# Altium schematic sheet P05_LED, Config, & Button.SchDoc
size A
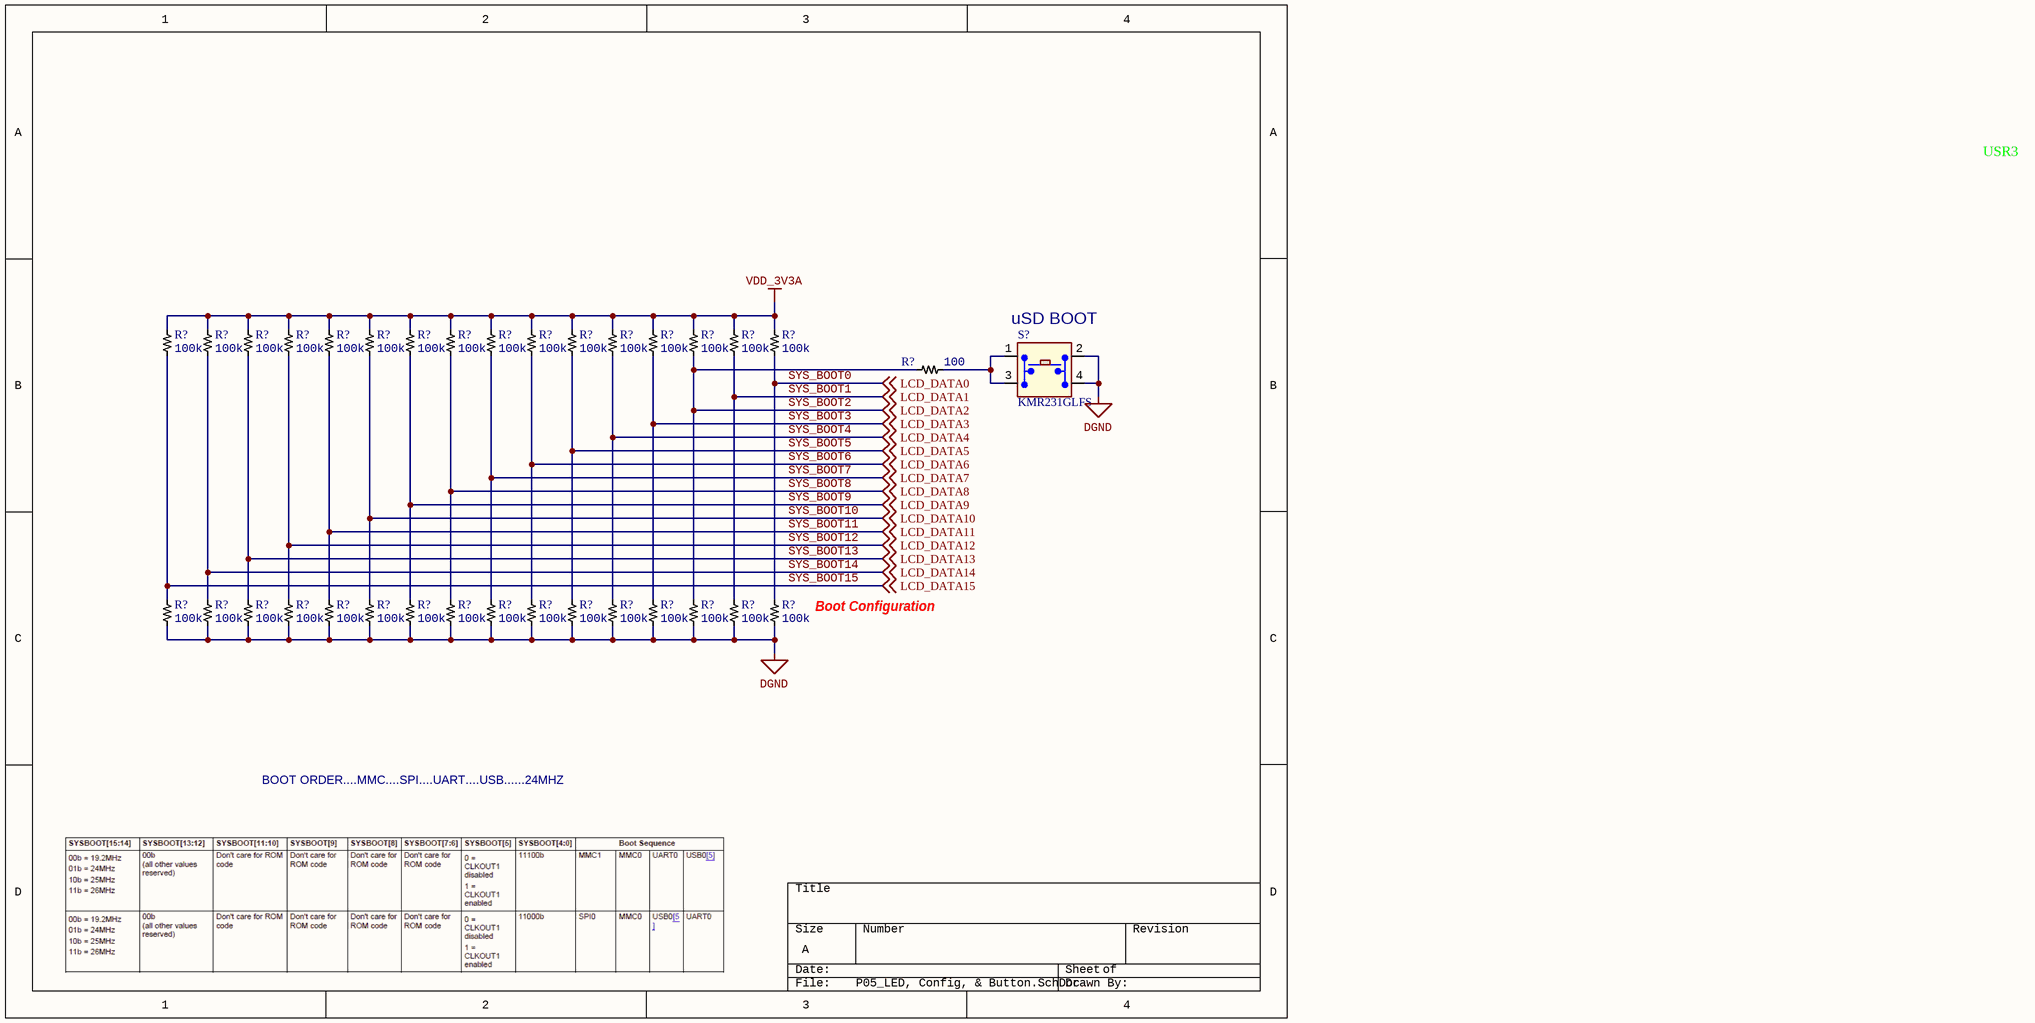
[diagram p0: P05_LED, Config, & Button.SchDoc]

## Parts
(Parts that share a designator on the sheet are numbered #1, #2 ... from top to bottom, then left to right.)
R?#1  Resistance: 100k  [RES0402]  (hidden comment: RC0402FR-07100KL)
R?#2  Resistance: 100k  [RES0402]  (hidden comment: RC0402FR-07100KL)
R?#3  Resistance: 100k  [RES0402]  (hidden comment: RC0402FR-07100KL)
R?#4  Resistance: 100k  [RES0402]  (hidden comment: RC0402FR-07100KL)
R?#5  Resistance: 100k  [RES0402]  (hidden comment: RC0402FR-07100KL)
R?#6  Resistance: 100k  [RES0402]  (hidden comment: RC0402FR-07100KL)
R?#7  Resistance: 100k  [RES0402]  (hidden comment: RC0402FR-07100KL)
R?#8  Resistance: 100k  [RES0402]  (hidden comment: RC0402FR-07100KL)
R?#9  Resistance: 100k  [RES0402]  (hidden comment: RC0402FR-07100KL)
R?#10  Resistance: 100k  [RES0402]  (hidden comment: RC0402FR-07100KL)
R?#11  Resistance: 100k  [RES0402]  (hidden comment: RC0402FR-07100KL)
R?#12  Resistance: 100k  [RES0402]  (hidden comment: RC0402FR-07100KL)
R?#13  Resistance: 100k  [RES0402]  (hidden comment: RC0402FR-07100KL)
R?#14  Resistance: 100k  [RES0402]  (hidden comment: RC0402FR-07100KL)
R?#15  Resistance: 100k  [RES0402]  (hidden comment: RC0402FR-07100KL)
R?#16  Resistance: 100k  [RES0402]  (hidden comment: RC0402FR-07100KL)
R?#17  Resistance: 100  [RES0402]  (hidden comment: RC0402FR-07100RL)
R?#18  Resistance: 100k  [RES0402]  (hidden comment: RC0402FR-07100KL)
R?#19  Resistance: 100k  [RES0402]  (hidden comment: RC0402FR-07100KL)
R?#20  Resistance: 100k  [RES0402]  (hidden comment: RC0402FR-07100KL)
R?#21  Resistance: 100k  [RES0402]  (hidden comment: RC0402FR-07100KL)
R?#22  Resistance: 100k  [RES0402]  (hidden comment: RC0402FR-07100KL)
R?#23  Resistance: 100k  [RES0402]  (hidden comment: RC0402FR-07100KL)
R?#24  Resistance: 100k  [RES0402]  (hidden comment: RC0402FR-07100KL)
R?#25  Resistance: 100k  [RES0402]  (hidden comment: RC0402FR-07100KL)
R?#26  Resistance: 100k  [RES0402]  (hidden comment: RC0402FR-07100KL)
R?#27  Resistance: 100k  [RES0402]  (hidden comment: RC0402FR-07100KL)
R?#28  Resistance: 100k  [RES0402]  (hidden comment: RC0402FR-07100KL)
R?#29  Resistance: 100k  [RES0402]  (hidden comment: RC0402FR-07100KL)
R?#30  Resistance: 100k  [RES0402]  (hidden comment: RC0402FR-07100KL)
R?#31  Resistance: 100k  [RES0402]  (hidden comment: RC0402FR-07100KL)
R?#32  Resistance: 100k  [RES0402]  (hidden comment: RC0402FR-07100KL)
R?#33  Resistance: 100k  [RES0402]  (hidden comment: RC0402FR-07100KL)
S?  KMR231GLFS  [SW4SMD_63X161LS]

## Nets
DGND: R?#18.1 R?#19.1 R?#20.1 R?#21.1 R?#22.1 R?#23.1 R?#24.1 R?#25.1 R?#26.1 R?#27.1 R?#28.1 R?#29.1 R?#30.1 R?#31.1 R?#32.1 R?#33.1 S?.2(A2) S?.4
VDD_3V3A: R?#1.2 R?#2.2 R?#3.2 R?#4.2 R?#5.2 R?#6.2 R?#7.2 R?#8.2 R?#9.2 R?#10.2 R?#11.2 R?#12.2 R?#13.2 R?#14.2 R?#15.2 R?#16.2
SYS_BOOT0: R?#16.1 R?#33.2 ; off-sheet LCD_DATA0  [also labelled LCD_DATA0]
SYS_BOOT1: R?#15.1 R?#32.2 ; off-sheet LCD_DATA1  [also labelled LCD_DATA1]
SYS_BOOT2: R?#14.1 R?#17.1 R?#31.2 ; off-sheet LCD_DATA2  [also labelled LCD_DATA2]
SYS_BOOT3: R?#13.1 R?#30.2 ; off-sheet LCD_DATA3  [also labelled LCD_DATA3]
SYS_BOOT4: R?#12.1 R?#29.2 ; off-sheet LCD_DATA4  [also labelled LCD_DATA4]
SYS_BOOT5: R?#11.1 R?#28.2 ; off-sheet LCD_DATA5  [also labelled LCD_DATA5]
SYS_BOOT6: R?#10.1 R?#27.2 ; off-sheet LCD_DATA6  [also labelled LCD_DATA6]
SYS_BOOT7: R?#9.1 R?#26.2 ; off-sheet LCD_DATA7  [also labelled LCD_DATA7]
SYS_BOOT8: R?#8.1 R?#25.2 ; off-sheet LCD_DATA8  [also labelled LCD_DATA8]
SYS_BOOT9: R?#7.1 R?#24.2 ; off-sheet LCD_DATA9  [also labelled LCD_DATA9]
SYS_BOOT10: R?#6.1 R?#23.2 ; off-sheet LCD_DATA10  [also labelled LCD_DATA10]
SYS_BOOT11: R?#5.1 R?#22.2 ; off-sheet LCD_DATA11  [also labelled LCD_DATA11]
SYS_BOOT12: R?#4.1 R?#21.2 ; off-sheet LCD_DATA12  [also labelled LCD_DATA12]
SYS_BOOT13: R?#3.1 R?#20.2 ; off-sheet LCD_DATA13  [also labelled LCD_DATA13]
SYS_BOOT14: R?#2.1 R?#19.2 ; off-sheet LCD_DATA14  [also labelled LCD_DATA14]
SYS_BOOT15: R?#1.1 R?#18.2 ; off-sheet LCD_DATA15  [also labelled LCD_DATA15]
NetR?#17_2: R?#17.2 S?.1(A1) S?.3(A3)

## Notes on the sheet
- USR3
- (near S?) uSD BOOT
- (near R?#33) Boot Configuration
- BOOT ORDER....MMC....SPI....UART....USB......24MHZ

## Library data of the parts
R?#1-R?#16 R?#18-R?#33 = RES_100k: Resistor 100kOhm 0402 SMD; Manufacturer: Yageo; Temperature Coefficient: 100ppm/°C; Tolerance: 1%; Power Rating: 63mW; Voltage Rating: 50V; Composition: Thick Film; Features: Moisture Resistant; Height: 0.016inch; Manufacturer Part Number: RC0402FR-07100KL; Number of Terminations: 2; Packaging: Tape and Reel; RoHS: Yes; Supplier 1: Mouser; Supplier Part Number 1: 603-RC0402FR-07100KL; Case/Package: 0402; Case Code (Metric): 1005; Case Code (Imperial): 0402; Min Operating Temperature: -55°C; Max Operating Temperature: 155°C; Package Quantity: 1; Termination: SMD/SMT; Military Standard: Not; Max Power Dissipation: 63mW; Working Voltage: 50V; Length: 0.039inch; Width: 0.02inch; Depth: 0.5mm; REACH SVHC: No SVHC; Lead Free: Lead Free; ComponentLink2Description: Datasheet; ComponentLink2URL: https://www.yageo.com/upload/media/product/productsearch/datasheet/rchip/PYu-RC_Group_51_RoHS_L_10.pdf; Supplier 2: Digi-Key; Supplier Part Number 2: 311-100KLRCT-ND
R?#17 = RES_100: Resistor 100Ohm 0402 SMD; Manufacturer: Yageo; Temperature Coefficient: 100ppm/°C; Tolerance: 1%; Power Rating: 62.5mW; Voltage Rating: 50V; ComponentLink1Description: https://datasheet.ciiva.com/7849/1784430-7849810.pdf?src-supplier=Element14; ComponentLink1URL: https://datasheet.ciiva.com/7849/1784430-7849810.pdf?src-supplier=Element14; Composition: Thick Film; Height: 0.32mm; Manufacturer Part Number: RC0402FR-07100RL; Packaging: Tape and Reel; Pricing 1: 1=0.10000, 10=0.01600, 100=0.00640, 1000=0.00289, 2500=0.00251, 5000=0.00207 (USD); RoHS: Yes; Stock 1: 45000776; Supplier 1: Digi-Key; Case/Package: 0402; Number of Pins: 2; Case Code (Imperial): 0402; Case Code (Metric): 1005; Min Operating Temperature: -55°C; Max Operating Temperature: 155°C; Military Standard: Not; Voltage Rating (DC): 50V; Termination: SMD/SMT; Length: 1mm; Width: 0.5mm; Depth: 0.5mm; REACH SVHC: No SVHC; Lead Free: Lead Free; ComponentLink2URL: https://datasheet.ciiva.com/11808/0900766b80c66297-11808765.pdf?src-supplier=RSComponents; ComponentLink2Description: https://datasheet.ciiva.com/11808/0900766b80c66297-11808765.pdf?src-supplier=RSComponents; ComponentLink3URL: https://datasheet.ciiva.com/12667/pyu-rc0402-51-rohs-l-6-r-12667957.pdf?src-supplier=Mouser; ComponentLink3Description: https://datasheet.ciiva.com/12667/pyu-rc0402-51-rohs-l-6-r-12667957.pdf?src-supplier=Mouser; ComponentLink4URL: https://datasheet.ciiva.com/22747/1018594-22747511.pdf?src-supplier=Element14; ComponentLink4Description: https://datasheet.ciiva.com/22747/1018594-22747511.pdf?src-supplier=Element14; ComponentLink5URL: https://datasheet.ciiva.com/28367/1018594-28367226.pdf?src-supplier=Element14; ComponentLink5Description: https://datasheet.ciiva.com/28367/1018594-28367226.pdf?src-supplier=Element14; ComponentLink6URL: https://datasheet.ciiva.com/16740/pyu-rc0402-51-rohs-l-6-r-16740566.pdf?src-supplier=Future+Electronics; ComponentLink6Description: https://datasheet.ciiva.com/16740/pyu-rc0402-51-rohs-l-6-r-16740566.pdf?src-supplier=Future+Electronics; ComponentLink7URL: https://datasheet.ciiva.com/15189/getdatasheetpartid-329466-15189335.pdf?src-supplier=Verical; ComponentLink7Description: https://datasheet.ciiva.com/15189/getdatasheetpartid-329466-15189335.pdf?src-supplier=Verical
S? = KMR2: Microminiature Tact Switch for SMT; Manufacturer: C&K Components; Circuit: SPST-NO; Switch Function: Off-Mom; Contact Rating @ Voltage: 0.05A @ 32VDC; Actuator Type: Standard; Actuator Height off PCB, from Pins: 1.90mm; Actuator Orientation: Top Actuated; Outline: 4.60mm x 2.80mm; Illumination: Non-Illuminated; Operating Force: 300gf; Switch Travel: 0.25mm; Mechanical Life: 150,000 Cycles; Supplier 1: Digi-Key; Supplier Part Number 1: 401-1429-6-ND; Manufacturer Part Number: KMR231GLFS; RoHS: RoHS Compliant; Category: Switches; Stock 1: 32289; Pricing 1: 1=0.44, 10=0.416, 25=0.3744, 50=0.3326, 100=0.3188, 250=0.29108, 500=0.2772, 1000=0.22869 (USD); Mounting Type: Surface Mount; Termination Style: Gull Wing; Illumination Voltage (Nominal): -; Illumination Type, Color: -; Ingress Protection: -; Features: Grounding Pin; Packaging: Digi-Reel®; Actuator Material: -; Operating Temperature: -40°C ~ 85°C; ComponentLink1URL: http://www.ck-components.com/index.php?module=media&action=Display&cmpref=14414&lang=en&width=&height=&format=&alt=; ComponentLink1Description: http://www.ck-components.com/index.php?module=media&action=Display&cmpref=14414&lang=en&width=&height=&format=&alt=